# EAGLE schematic binary updown (EAGLE 6.0)
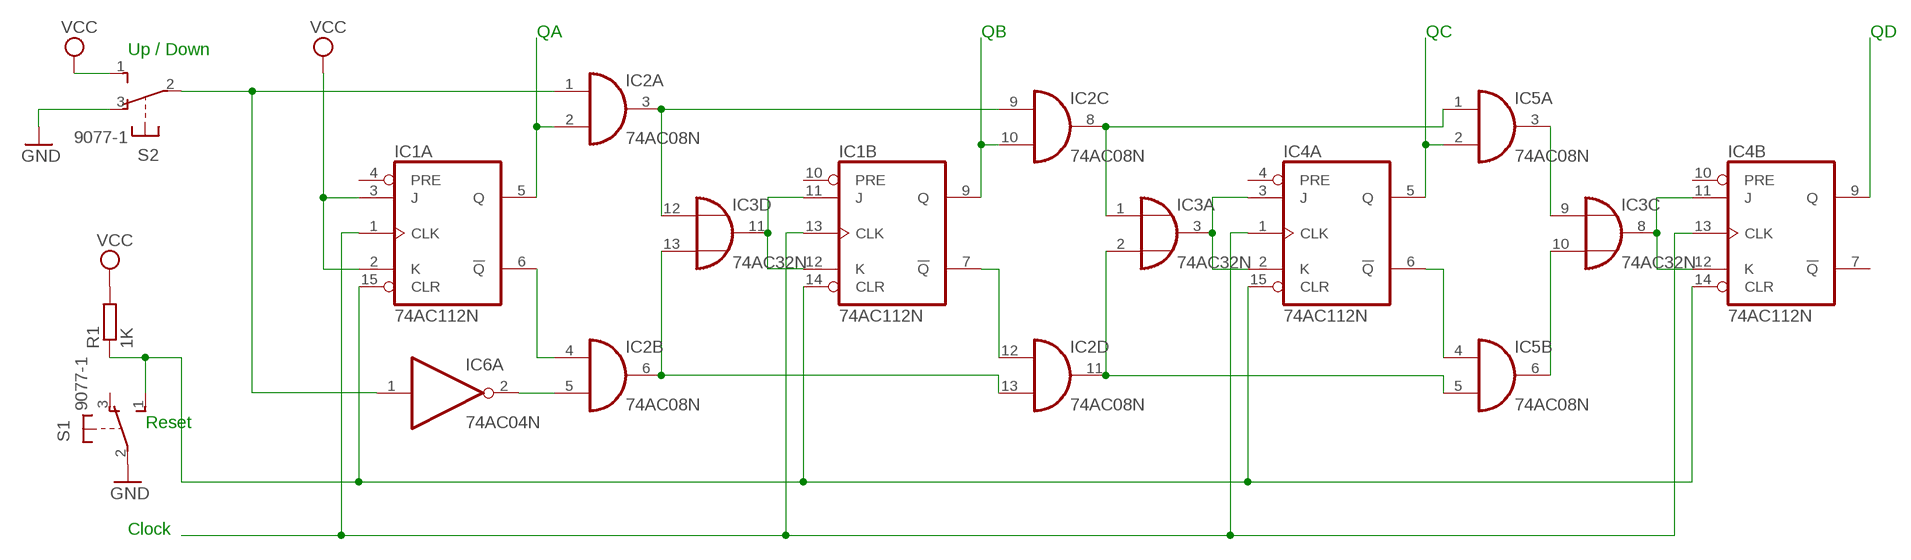
[diagram p0: schematic, sheet 1]

## Parts
IC1  74AC112N  [DIL16]
IC2  74AC08N  [DIL14]
IC3  74AC32N  [DIL14]
IC4  74AC112N  [DIL16]
IC5  74AC08N  [DIL14]
IC6  74AC04N  [DIL14]
R1  1K  R-EU_0204/7  [0204/7]
S1  9077-1  [9077-1]
S2  9077-1  [9077-1]

## Nets
GND: S1.2(P) S2.3(O)
N$1: IC1.11(B:J) IC1.12(B:K) IC3.11(D:O)
N$2: IC3.3(A:O) IC4.2(A:K) IC4.3(A:J)
N$3: IC3.8(C:O) IC4.11(B:J) IC4.12(B:K)
N$4: IC2.3(A:O) IC2.9(C:I0) IC3.12(D:I0)
N$5: IC2.6(B:O) IC2.13(D:I1) IC3.13(D:I1)
N$6: IC2.8(C:O) IC3.1(A:I0) IC5.1(A:I0)
N$7: IC2.11(D:O) IC3.2(A:I1) IC5.5(B:I1)
N$8: IC3.9(C:I0) IC5.3(A:O)
N$9: IC3.10(C:I1) IC5.6(B:O)
N$10: IC1.7(B:!Q) IC2.12(D:I0)
N$11: IC1.5(A:Q) IC2.2(A:I1)
N$12: IC1.9(B:Q) IC2.10(C:I1)
N$13: IC4.5(A:Q) IC5.2(A:I1)
N$14: IC4.6(A:!Q) IC5.4(B:I0)
N$15: IC2.1(A:I0) IC6.1(A:I) S2.2(P)
N$16: IC4.9(B:Q)
N$17: IC1.1(A:CLK) IC1.13(B:CLK) IC4.1(A:CLK) IC4.13(B:CLK)
N$18: IC1.6(A:!Q) IC2.4(B:I0)
N$19: IC2.5(B:I1) IC6.2(A:O)
N$20: IC1.14(B:CLR) IC1.15(A:CLR) IC4.14(B:CLR) IC4.15(A:CLR) R1.1 S1.1(S)
VCC: IC1.2(A:K) IC1.3(A:J) R1.2 S2.1(S)
Unconnected: IC1.4(A:PRE) IC1.10(B:PRE) IC3.4(B:I0) IC3.5(B:I1) IC3.6(B:O) IC4.4(A:PRE) IC4.7(B:!Q) IC4.10(B:PRE) IC5.8(C:O) IC5.9(C:I0) IC5.10(C:I1) IC5.11(D:O) IC5.12(D:I0) IC5.13(D:I1) IC6.3(B:I) IC6.4(B:O) IC6.5(C:I) IC6.6(C:O) IC6.8(D:O) IC6.9(D:I) IC6.10(E:O) IC6.11(E:I) IC6.12(F:O) IC6.13(F:I) S1.3(O)

## Notes on the sheet
- QA | QB | QC | QD
- Up / Down
- Reset
- Clock

## Power pins joined to a net without a drawn wire
GND: IC1.8(P:GND) IC2.7(P:GND) IC3.7(P:GND) IC4.8(P:GND) IC5.7(P:GND) IC6.7(P:GND)
VCC: IC1.16(P:VCC) IC2.14(P:VCC) IC3.14(P:VCC) IC4.16(P:VCC) IC5.14(P:VCC) IC6.14(P:VCC)

## Library data of the parts
IC1 IC4 = 74xx-eu:74*112: Dual J-K negative edge triggered FLIP FLOP, preset and clear
IC2 IC5 = 74xx-eu:74*08: Quad 2-input AND gate
IC3 = 74xx-eu:74*32: Quad 2-input OR gate
IC6 = 74xx-eu:74*04: Hex INVERTER
R1 = rcl:R-EU_: RESISTOR, European symbol
S1 S2 = switch-misc:9077-1: MARQUARDT SWITCH 9077.0100 Distributor: Buerklin <https://www.buerklin.com/default.asp?event=ShowArtikel%2812G2820%29&l=d&jump=ArtNr_12G2820>